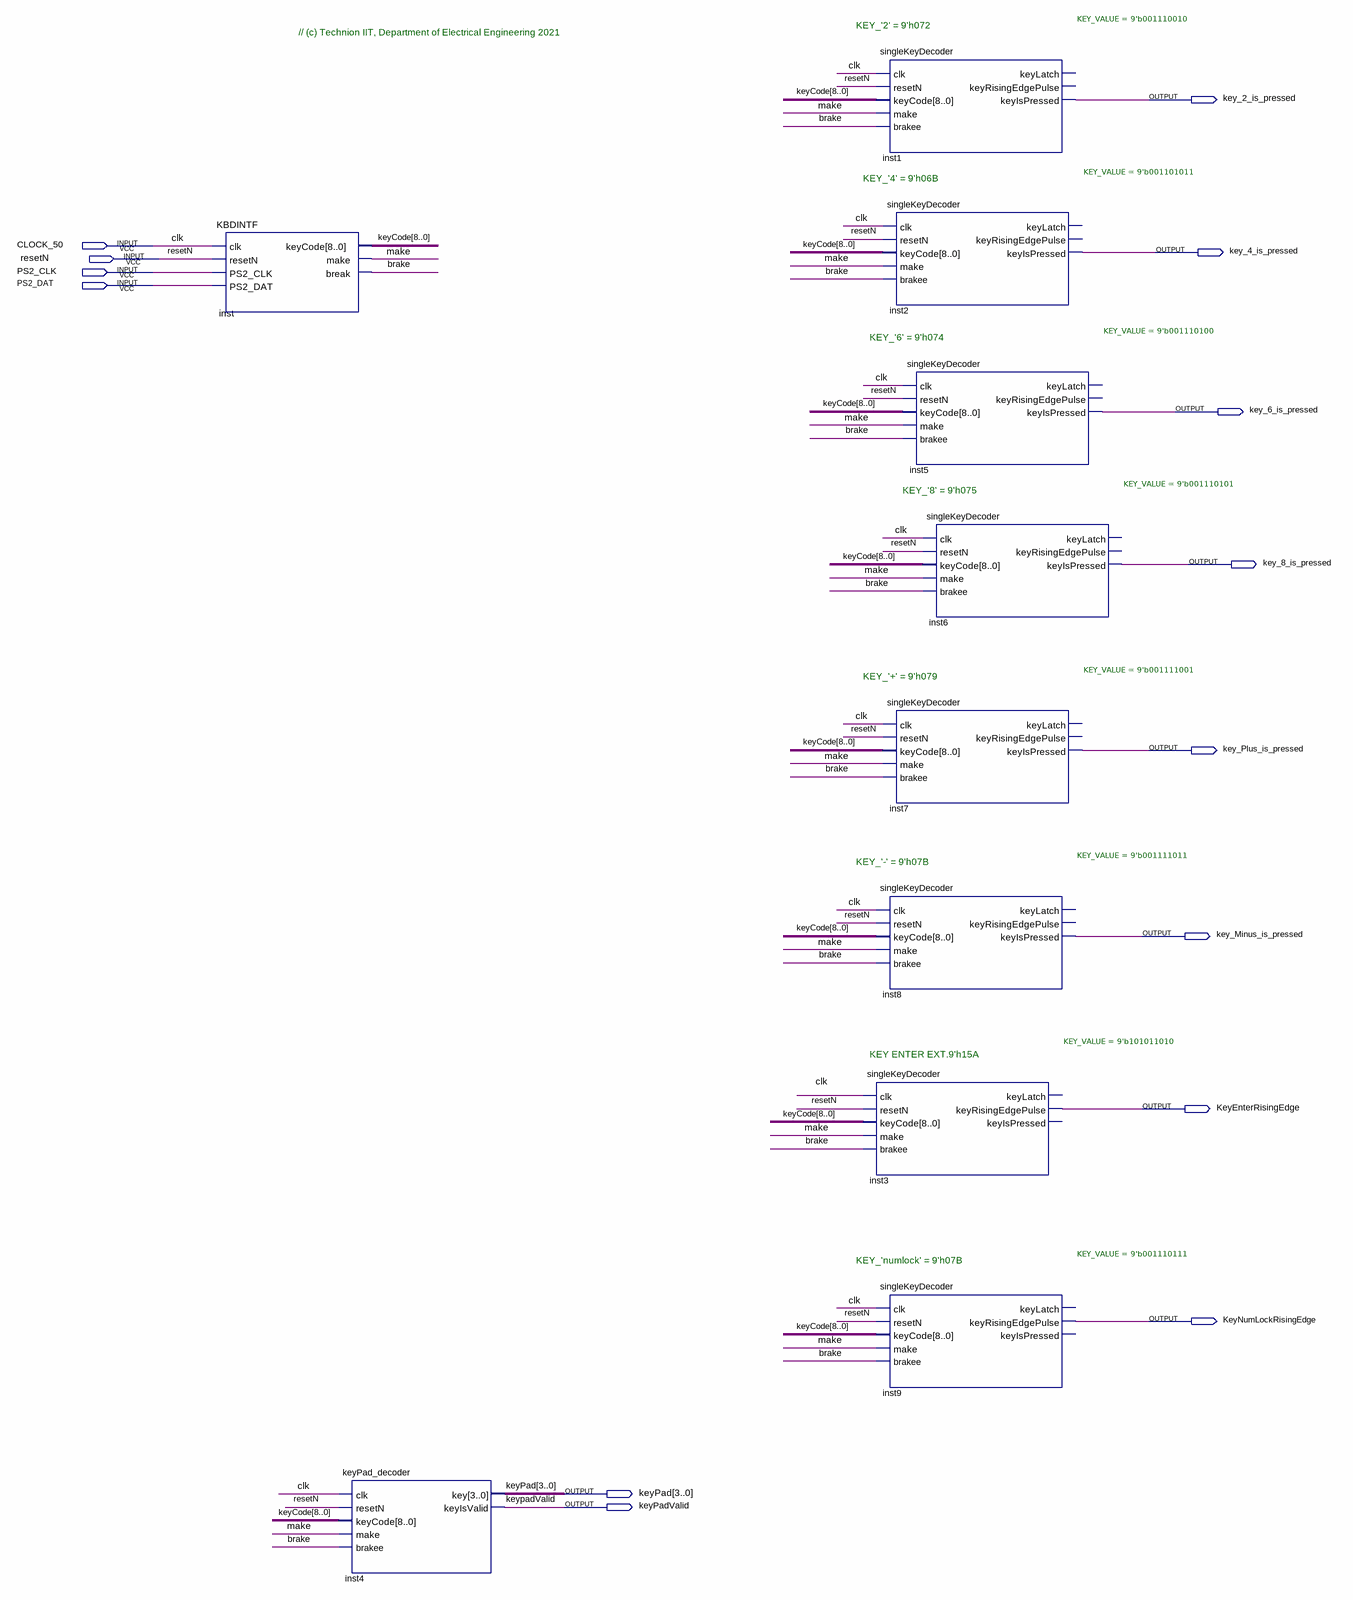
[diagram p0: schematic sheet]
// Quartus schematic KEYBOARD_DECODER.bdf as structural Verilog: 10 symbols, 14 pins
module KEYBOARD_DECODER (
  input  CLOCK_50,
  input  resetN,
  input  PS2_CLK,
  input  PS2_DAT,
  output key_2_is_pressed,
  output key_4_is_pressed,
  output key_6_is_pressed,
  output key_8_is_pressed,
  output key_Plus_is_pressed,
  output key_Minus_is_pressed,
  output KeyEnterRisingEdge,
  output KeyNumLockRisingEdge,
  output [3:0] keyPad,
  output keyPadValid
);

  wire brake, make;
  wire [8:0] keyCode;

  KBDINTF inst (
    .clk(CLOCK_50), .resetN(resetN), .PS2_CLK(PS2_CLK), .PS2_DAT(PS2_DAT), .keyCode(keyCode), .make(make),
    .\break (brake));
  keyPad_decoder inst4 (
    .clk(CLOCK_50), .resetN(resetN), .keyCode(keyCode), .make(make), .brakee(brake), .key(keyPad),
    .keyIsValid(keyPadValid));
  singleKeyDecoder #(.KEY_VALUE(9'b101011010)) inst3 (
    .clk(CLOCK_50), .resetN(resetN), .keyCode(keyCode), .make(make), .brakee(brake),
    .keyRisingEdgePulse(KeyEnterRisingEdge));  // open: keyLatch, keyIsPressed
  singleKeyDecoder #(.KEY_VALUE(9'b001110010)) inst1 (
    .clk(CLOCK_50), .resetN(resetN), .keyCode(keyCode), .make(make), .brakee(brake),
    .keyIsPressed(key_2_is_pressed));  // open: keyLatch, keyRisingEdgePulse
  singleKeyDecoder #(.KEY_VALUE(9'b001101011)) inst2 (
    .clk(CLOCK_50), .resetN(resetN), .keyCode(keyCode), .make(make), .brakee(brake),
    .keyIsPressed(key_4_is_pressed));  // open: keyLatch, keyRisingEdgePulse
  singleKeyDecoder #(.KEY_VALUE(9'b001110100)) inst5 (
    .clk(CLOCK_50), .resetN(resetN), .keyCode(keyCode), .make(make), .brakee(brake),
    .keyIsPressed(key_6_is_pressed));  // open: keyLatch, keyRisingEdgePulse
  singleKeyDecoder #(.KEY_VALUE(9'b001111001)) inst7 (
    .clk(CLOCK_50), .resetN(resetN), .keyCode(keyCode), .make(make), .brakee(brake),
    .keyIsPressed(key_Plus_is_pressed));  // open: keyLatch, keyRisingEdgePulse
  singleKeyDecoder #(.KEY_VALUE(9'b001111011)) inst8 (
    .clk(CLOCK_50), .resetN(resetN), .keyCode(keyCode), .make(make), .brakee(brake),
    .keyIsPressed(key_Minus_is_pressed));  // open: keyLatch, keyRisingEdgePulse
  singleKeyDecoder #(.KEY_VALUE(9'b001110111)) inst9 (
    .clk(CLOCK_50), .resetN(resetN), .keyCode(keyCode), .make(make), .brakee(brake),
    .keyRisingEdgePulse(KeyNumLockRisingEdge));  // open: keyLatch, keyIsPressed
  singleKeyDecoder #(.KEY_VALUE(9'b001110101)) inst6 (
    .clk(CLOCK_50), .resetN(resetN), .keyCode(keyCode), .make(make), .brakee(brake),
    .keyIsPressed(key_8_is_pressed));  // open: keyLatch, keyRisingEdgePulse

  // Other names for the same wires on the sheet: clk = CLOCK_50

  // Notes on the sheet:
  //   KEY_'2' = 9'h072       
  //   // (c) Technion IIT, Department of Electrical Engineering 2021 
  //   KEY_'4' = 9'h06B          
  //   KEY_'6' = 9'h074         
  //   KEY_'8' = 9'h075        
  //   KEY_'+' = 9'h079        
  //   KEY_'-' = 9'h07B          
  //   KEY ENTER EXT.9'h15A         
  //   KEY_'numlock' = 9'h07B          
endmodule
